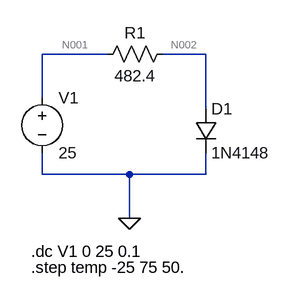
[diagram p0: schematic Diodo4148_1.asc]
Diodo4148_1.asc, the LTspice schematic file:
Version 4.1
SHEET 1 880 680
WIRE -224 208 -320 208
WIRE -80 208 -144 208
WIRE -320 272 -320 208
WIRE -80 288 -80 208
WIRE -320 384 -320 352
WIRE -192 384 -320 384
WIRE -80 384 -80 352
WIRE -80 384 -192 384
WIRE -192 448 -192 384
FLAG -192 448 0
SYMBOL voltage -320 256 R0
WINDOW 123 0 0 Left 0
WINDOW 39 0 0 Left 0
SYMATTR InstName V1
SYMATTR Value 25
SYMBOL res -128 192 R90
WINDOW 0 0 56 VBottom 2
WINDOW 3 32 56 VTop 2
SYMATTR InstName R1
SYMATTR Value 482.4
SYMBOL diode -96 288 R0
SYMATTR InstName D1
SYMATTR Value 1N4148
TEXT -336 496 Left 2 !.dc V1 0 25 0.1
TEXT -336 520 Left 2 !.step temp -25 75 50.

The netlist it stands for:
* Diodo4148_1.asc
V1 N001 0 25
R1 N002 N001 482.4
D1 N002 0 1N4148
.model D D
.lib standard.dio
.dc V1 0 25 0.1
.step temp -25 75 50.
.backanno
.end

* Results of the author's LTspice run, read from the files saved beside the schematic
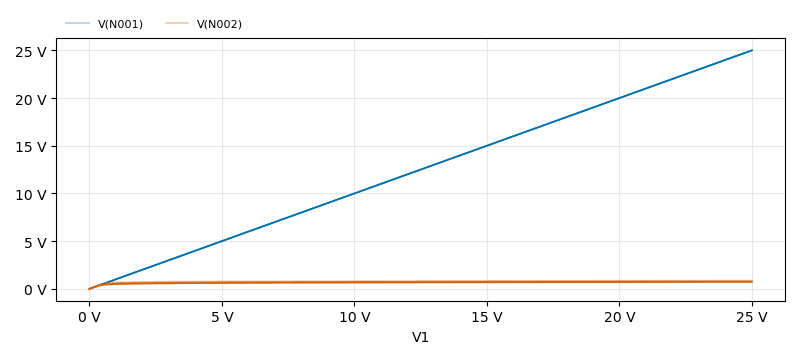
[diagram p1: DC transfer characteristic of Diodo4148_1.asc, plotted from the saved traces]
* DC transfer characteristic, 3 runs:
*   V(N001) [run 1]: 0 V at V1=0 V, 25 V at V1=25 V, min 0 V, max 25 V
*   V(N001) [run 2]: 0 V at V1=0 V, 25 V at V1=25 V, min 0 V, max 25 V
*   V(N001) [run 3]: 0 V at V1=0 V, 25 V at V1=25 V, min 0 V, max 25 V
*   V(N002) [run 1]: 0 V at V1=0 V, 862.5 mV at V1=25 V, min 0 V, max 862.5 mV
*   V(N002) [run 2]: 0 V at V1=0 V, 792.9 mV at V1=25 V, min 0 V, max 792.9 mV
*   V(N002) [run 3]: 0 V at V1=0 V, 721.3 mV at V1=25 V, min 0 V, max 721.3 mV